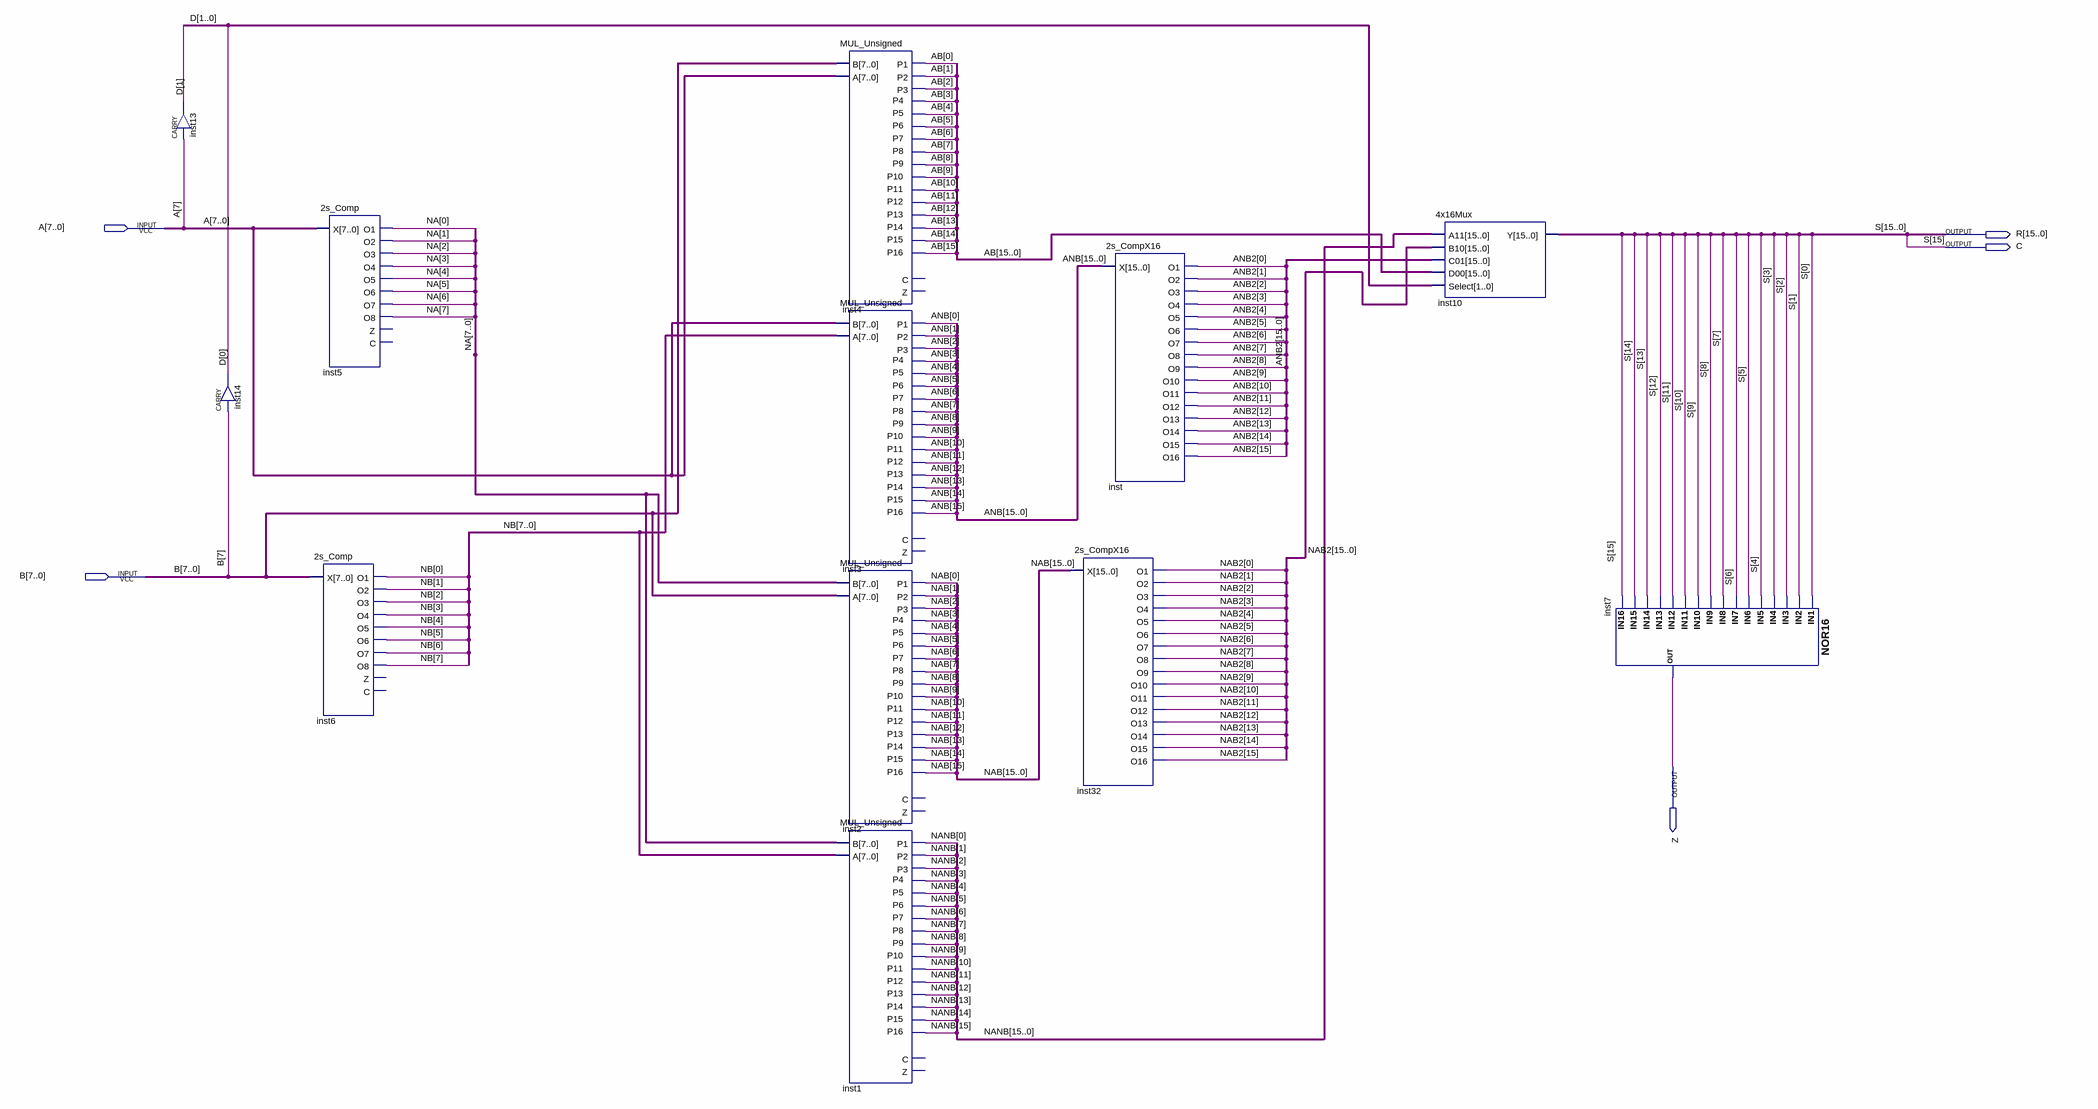
[diagram p0: schematic sheet]
// Quartus schematic MULS.bdf as structural Verilog: 12 symbols, 5 pins
module MULS (
  input  [7:0] A,
  input  [7:0] B,
  output [15:0] R,
  output C,
  output Z
);

  wire [1:0] D;
  wire [7:0] NA, NB;
  wire [15:0] AB, ANB, ANB2, NAB, NAB2, NANB;

  CARRY inst13 (.IN(A[7]), .OUT(D[1]));
  CARRY inst14 (.IN(B[7]), .OUT(D[0]));
  \2s_Comp  inst5 (
    .X(A), .O1(NA[0]), .O2(NA[1]), .O3(NA[2]), .O4(NA[3]), .O5(NA[4]), .O6(NA[5]), .O7(NA[6]), .O8(NA[7]));  // open: Z, C
  \2s_Comp  inst6 (
    .X(B), .O1(NB[0]), .O2(NB[1]), .O3(NB[2]), .O4(NB[3]), .O5(NB[4]), .O6(NB[5]), .O7(NB[6]), .O8(NB[7]));  // open: Z, C
  MUL_Unsigned inst4 (
    .B(B), .A(A), .P1(AB[0]), .P2(AB[1]), .P3(AB[2]), .P4(AB[3]), .P5(AB[4]), .P6(AB[5]), .P7(AB[6]),
    .P8(AB[7]), .P9(AB[8]), .P10(AB[9]), .P11(AB[10]), .P12(AB[11]), .P13(AB[12]), .P14(AB[13]),
    .P15(AB[14]), .P16(AB[15]));  // open: Z, C
  MUL_Unsigned inst3 (
    .B(A), .A(NB), .P1(ANB[0]), .P2(ANB[1]), .P3(ANB[2]), .P4(ANB[3]), .P5(ANB[4]), .P6(ANB[5]), .P7(ANB[6]),
    .P8(ANB[7]), .P9(ANB[8]), .P10(ANB[9]), .P11(ANB[10]), .P12(ANB[11]), .P13(ANB[12]), .P14(ANB[13]),
    .P15(ANB[14]), .P16(ANB[15]));  // open: Z, C
  MUL_Unsigned inst2 (
    .B(NA), .A(B), .P1(NAB[0]), .P2(NAB[1]), .P3(NAB[2]), .P4(NAB[3]), .P5(NAB[4]), .P6(NAB[5]), .P7(NAB[6]),
    .P8(NAB[7]), .P9(NAB[8]), .P10(NAB[9]), .P11(NAB[10]), .P12(NAB[11]), .P13(NAB[12]), .P14(NAB[13]),
    .P15(NAB[14]), .P16(NAB[15]));  // open: Z, C
  MUL_Unsigned inst1 (
    .B(NA), .A(NB), .P1(NANB[0]), .P2(NANB[1]), .P3(NANB[2]), .P4(NANB[3]), .P5(NANB[4]), .P6(NANB[5]),
    .P7(NANB[6]), .P8(NANB[7]), .P9(NANB[8]), .P10(NANB[9]), .P11(NANB[10]), .P12(NANB[11]), .P13(NANB[12]),
    .P14(NANB[13]), .P15(NANB[14]), .P16(NANB[15]));  // open: Z, C
  \2s_CompX16  inst (
    .X(ANB), .O1(ANB2[0]), .O2(ANB2[1]), .O3(ANB2[2]), .O4(ANB2[3]), .O5(ANB2[4]), .O6(ANB2[5]),
    .O7(ANB2[6]), .O8(ANB2[7]), .O9(ANB2[8]), .O10(ANB2[9]), .O11(ANB2[10]), .O12(ANB2[11]), .O13(ANB2[12]),
    .O14(ANB2[13]), .O15(ANB2[14]), .O16(ANB2[15]));
  \2s_CompX16  inst32 (
    .X(NAB), .O1(NAB2[0]), .O2(NAB2[1]), .O3(NAB2[2]), .O4(NAB2[3]), .O5(NAB2[4]), .O6(NAB2[5]),
    .O7(NAB2[6]), .O8(NAB2[7]), .O9(NAB2[8]), .O10(NAB2[9]), .O11(NAB2[10]), .O12(NAB2[11]), .O13(NAB2[12]),
    .O14(NAB2[13]), .O15(NAB2[14]), .O16(NAB2[15]));
  \4x16Mux  inst10 (.A11(NANB), .B10(NAB2), .C01(ANB2), .D00(AB), .Select(D), .Y({C, R[14:0]}));
  nor inst7 (Z, R[0], R[1], R[2], R[3], R[4], R[5], R[6], R[7], R[8], R[9], R[10], R[11], R[12], R[13], R[14], C);

  assign R[15] = C;

  // Other names for the same wires on the sheet: S[15:0] = {C, R[14:0]}
endmodule
